# Altium schematic sheet 2_LDO+5V.SchDoc
size A4; SheetNumber: 3; SheetTotal: 12
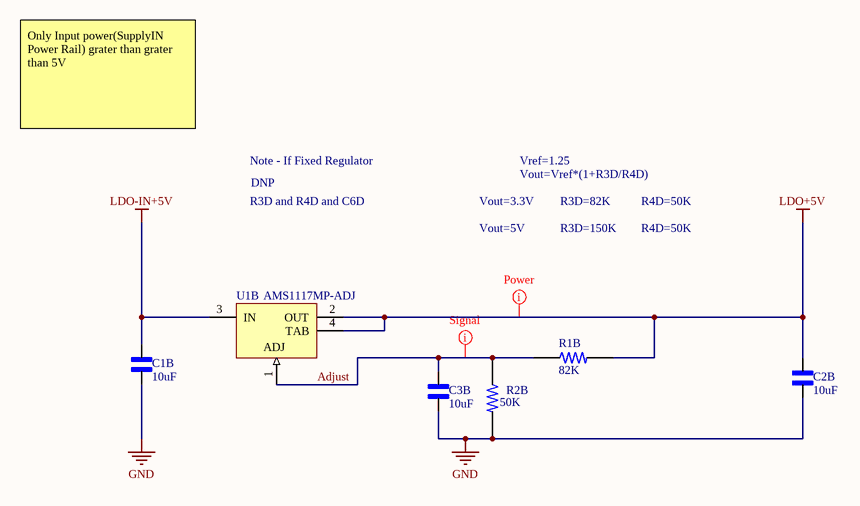
[diagram p0: 2_LDO+5V.SchDoc]

## Parts
C1B  10uF  [C-0603]
C2B  10uF  [C-0603]
C3B  10uF  [C-0603]
R1B  82K  [R-0603]
R2B  50K  [R-0603]
U1B  AMS1117MP-ADJ  [MP04A_N]

## Nets
GND: C1B.1 C2B.1 C3B.1 R2B.2
LDO+5V: C2B.2 R1B.2 U1B.2(OUT) U1B.4(TAB)
LDO-IN+5V: C1B.2 U1B.3(IN)
Adjust: C3B.2 R1B.1 R2B.1 U1B.1(ADJ)

## Layout directives
net class Power: LDO+5V
net class Signal: Adjust

## Notes on the sheet
- Only Input power(SupplyIN Power Rail) grater than grater than 5V
- Note - If Fixed Regulator
- DNP
- Vout=Vref*(1+R3D/R4D)
- Vref=1.25
- R3D and R4D and C6D
- Vout=3.3V
- Vout=5V
- R3D=82K
- R3D=150K
- R4D=50K

## Library data of the parts
C1B C2B C3B = C-0603: Ceramic Capacitor 16V 0603 (1608 Metric); MP: C0603C104J4RAC; MF: KEMET; SnapEDA_Link: https://www.snapeda.com/parts/C0603C104J4RAC/KEMET/view-part/1763758/?ref=snap; Availability: Warning; Package: 0603 KEMET; Check_prices: https://www.snapeda.com/parts/C0603C104J4RAC/KEMET/view-part/1763758/?ref=eda; Price: None
  C1B C2B: Value: *
  C3B: Value: 10uF
R1B R2B = R-0603: 0603; MP: 2-1623703-0; Power_Rating: .1 W; Value: 10K; Tolerance: 1%; MF: TE Connectivity; Package: 0603; Price: None; Resistance: 10K; Check_prices: https://www.snapeda.com/parts/2-1623703-0/TE%20Connectivity/view-part/2213192/?ref=eda; SnapEDA_Link: https://www.snapeda.com/parts/2-1623703-0/TE%20Connectivity/view-part/2213192/?ref=snap; Availability: Warning
U1B = CMP-0062-01645-3: 800mA Low-Dropout Linear Regulator, 4-pin SOT-223; PartNumber: LM1117MP-ADJ; Manufacturer: National Semiconductor; High-Reliability: Y; PackageTopMarking: XYTT*N03A; CompType: LDO IC; PowerWise: N; ComponentLink2URL: http://www.national.com/ds/LM/LM1117.pdf; ComponentLink1Description: Manufacturer URL; DatasheetVersion: Apr-2006; PackageReference: MP04A; RoHS: N; ComponentLink3Description: LM1117 Web Page; RevisionNote: SCH symbol layout adjusted; PackageDescription: Molded SOT-223, 6.50 x 3.56 x 1.6mm Body, 4 Lead, 2.3mm Pitch; Code_IPC: SOT223-4; ComponentLink1URL: http://www.national.com/; ComponentLink4Description: MP04A Package Page; ComponentLink3URL: http://www.national.com/pf/LM/LM1117.html; PackageVersion: revB, Apr-2003; ComponentLink2Description: LM1117 Datasheet; PinCount: 4; ComponentLink4URL: http://www.national.com/packaging/folders/mp04a.html; Code_JEDEC: TO-261-AA